# Altium schematic sheet MIDI.Schematic.SchDoc
size A
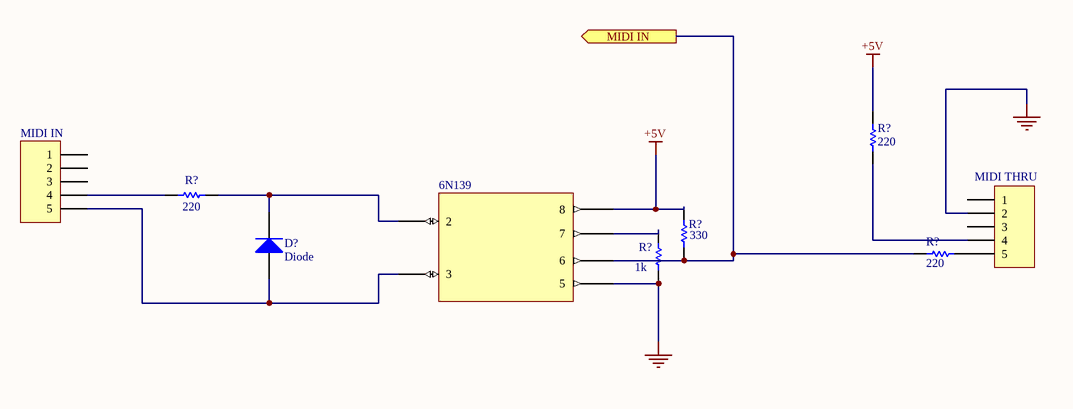
[diagram p0: MIDI.Schematic.SchDoc]

## Parts
(Parts that share a designator on the sheet are numbered #1, #2 ... from top to bottom, then left to right.)
6N139  6N139  (value not drawn)
D?  Diode  [SMC]
MIDI_IN  Header 5  [HDR1X5]  (value not drawn)
MIDI_THRU  Header 5  [HDR1X5]  (value not drawn)
R?#1  value 220  [AXIAL-0.3]  (hidden comment: Res1)
R?#2  value 220  [AXIAL-0.3]  (hidden comment: Res1)
R?#3  330  [AXIAL-0.3]
R?#4  value 220  [AXIAL-0.3]  (hidden comment: Res1)
R?#5  1k  [AXIAL-0.3]

## Ports
MIDI IN (out)

## Nets
+5V: 6N139.?3(8) R?#1.2 R?#3.2
GND: 6N139.?4(5) MIDI_THRU.2 R?#5.1
MIDI IN: 6N139.?6(6) R?#3.1 R?#4.2 ; port MIDI IN
Net6N139_?1: 6N139.?1(3) D?.1(A) MIDI_IN.5
Net6N139_?2: 6N139.?2(2) D?.2(K) R?#2.2
Net6N139_?5: 6N139.?5(7) R?#5.2
NetMIDI_IN_4: MIDI_IN.4 R?#2.1
NetMIDI_THRU_4: MIDI_THRU.4 R?#1.1
NetMIDI_THRU_5: MIDI_THRU.5 R?#4.1

Not connected (* = marked no-connect by the designer): MIDI_IN 1 2 3; MIDI_THRU 1 3

## Library data of the parts
D? = Diode: Default Diode; Published: 8-Jun-2000; LatestRevisionDate: 17-Jul-2002; LatestRevisionNote: Re-released for DXP Platform.; PackageVersion: Sep-1996; PackageReference: SMC; Publisher: Altium Limited; PackageDescription: DO-214-AB/SMC; 2 C-Bend Leads; Body 7.9 x 5.9 mm, inc. leads (LxW); Code_JEDEC: DO-214-AB
MIDI_IN MIDI_THRU = Header 5: DIN 5 Pins; LatestRevisionDate: 17-Jul-2002; LatestRevisionNote: Re-released for DXP Platform.; Publisher: Altium Limited
R?#1-R?#5 = Res1: Resistor; Published: 8-Jun-2000; LatestRevisionDate: 17-Jul-2002; LatestRevisionNote: Re-released for DXP Platform.; PackageReference: AXIAL-0.3; Publisher: Altium Limited; PackageDescription: Axial Device, Thru-Hole; 2 Leads; 0.3 in Pin Spacing
  R?#3: Value: 330
  R?#5: Value: 1K